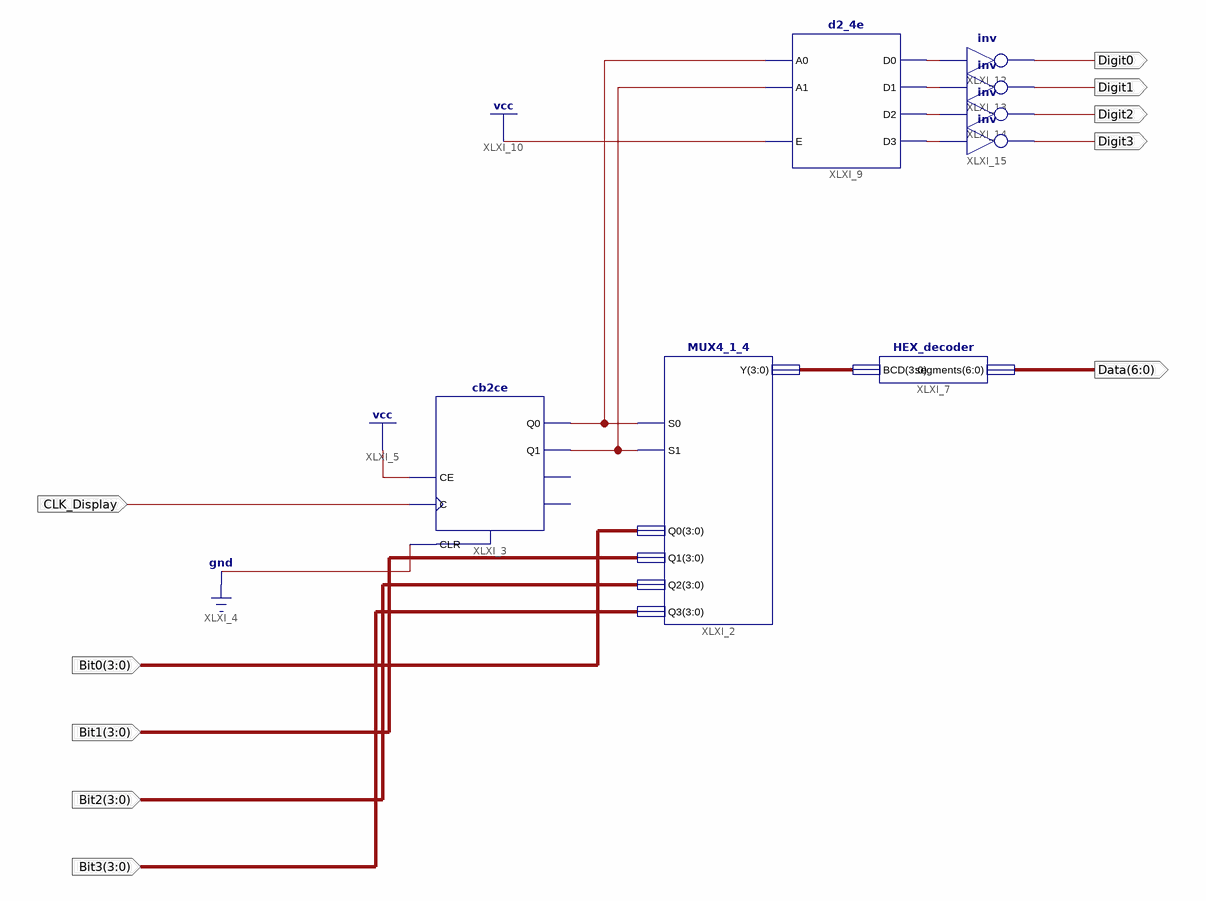
[diagram p0: schematic sheet 1]
// Xilinx ISE schematic DIsplay.sch (spartan6) as structural Verilog: 8 symbols, 10 ports
module DIsplay (
  input  CLK_Display,
  input  [3:0] Bit1,
  input  [3:0] Bit2,
  input  [3:0] Bit3,
  input  [3:0] Bit0,
  output [6:0] Data,
  output Digit0,
  output Digit1,
  output Digit2,
  output Digit3
);

  wire XLXN_16, XLXN_18, XLXN_24, XLXN_25, XLXN_26, XLXN_27;
  wire [3:0] XLXN_2;

  MUX4_1_4 XLXI_2 (.Q0(Bit0), .Q1(Bit1), .S0(XLXN_16), .S1(XLXN_18), .Q2(Bit2), .Q3(Bit3), .Y(XLXN_2));
  cb2ce XLXI_3 (.C(CLK_Display), .CE(1'b1), .CLR(1'b0), .Q0(XLXN_16), .Q1(XLXN_18));  // open: CEO, TC
  HEX_decoder XLXI_7 (.BCD(XLXN_2), .segments(Data));
  d2_4e XLXI_9 (.A0(XLXN_16), .A1(XLXN_18), .E(1'b1), .D0(XLXN_24), .D1(XLXN_25), .D2(XLXN_26), .D3(XLXN_27));
  not XLXI_12 (Digit0, XLXN_24);
  not XLXI_13 (Digit1, XLXN_25);
  not XLXI_14 (Digit2, XLXN_26);
  not XLXI_15 (Digit3, XLXN_27);
endmodule
